# EAGLE design displayhuhu (EAGLE 9.5.1)
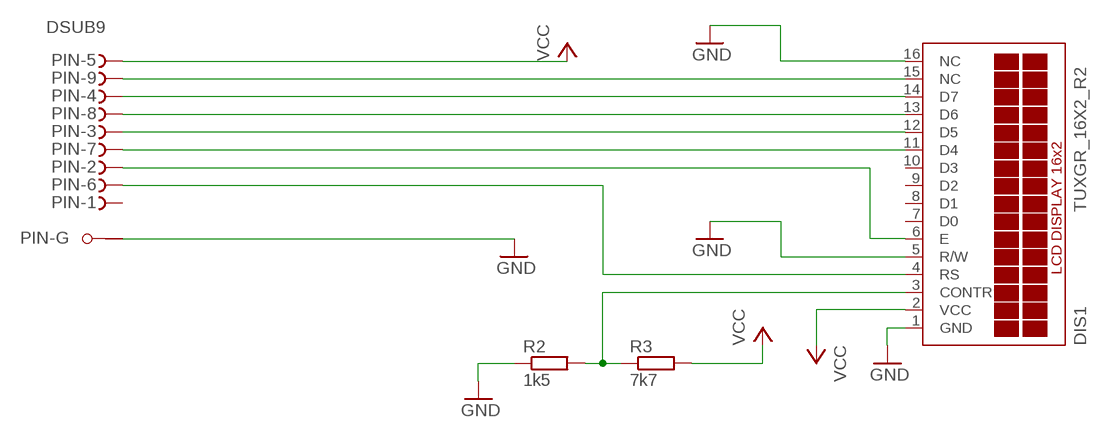
[diagram p0: schematic, sheet 1]

## Parts
DIS1  TUXGR_16X2_R2  [TUXGR_16X2_R2]
PIN  DSUB9  F09HPS  [F09HP]
R2  1k5  R-EU_0207/10  [0207/10]
R3  7k7  R-EU_0207/10  [0207/10]

## Nets
GND: DIS1.1(GND) DIS1.5(R/W) DIS1.16(NC) PIN.G1(-G:G1) R2.1
N$1: DIS1.6(E) PIN.2(-2:F)
N$2: DIS1.11(D4) PIN.7(-7:F)
N$3: DIS1.12(D5) PIN.3(-3:F)
N$4: DIS1.13(D6) PIN.8(-8:F)
N$5: DIS1.14(D7) PIN.4(-4:F)
N$6: DIS1.15(NC) PIN.9(-9:F)
N$8: DIS1.4(RS) PIN.6(-6:F)
N$9: DIS1.3(CONTR) R2.2 R3.1
VCC: DIS1.2(VCC) PIN.5(-5:F) R3.2
Unconnected: DIS1.7(D0) DIS1.8(D1) DIS1.9(D2) DIS1.10(D3) PIN.1(-1:F) PIN.G2(-G:G2)

## Library data of the parts
DIS1 = display-lcd:TUXGR_16X2_R2: Tuxgraphics LCD display 16x2 characters reflective, without background light Source: tuxgr_12x2_r2.pdf; OC_FARNELL: unknown; OC_NEWARK: unknown
PIN = con-subd:F09HPS: SUB-D; OC_FARNELL: unknown; OC_NEWARK: unknown
R2 R3 = rcl:R-EU_: RESISTOR, European symbol; SPICEPREFIX: R

## Board
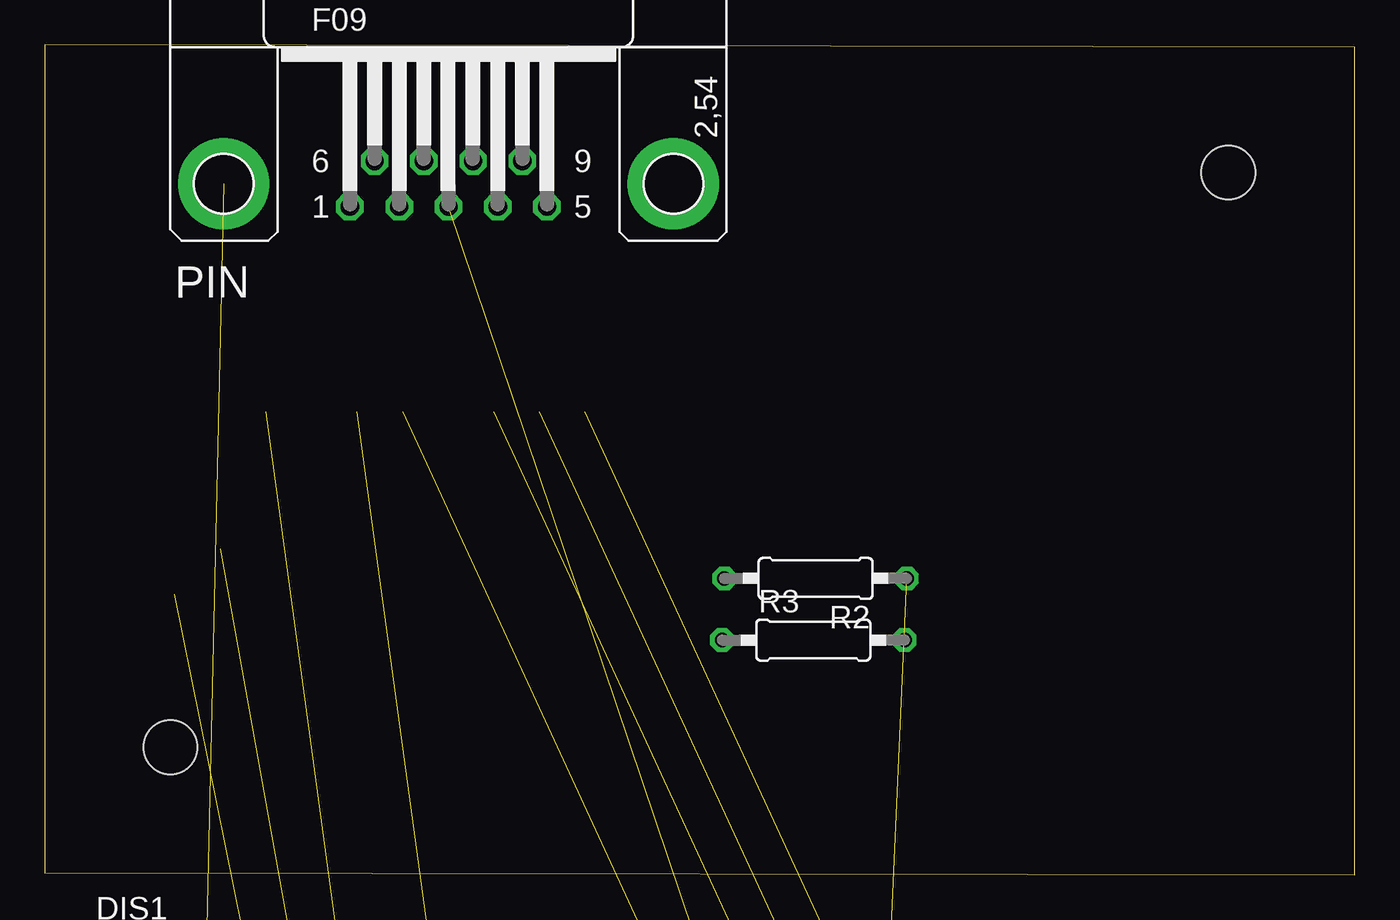
[diagram p1: board, top side]
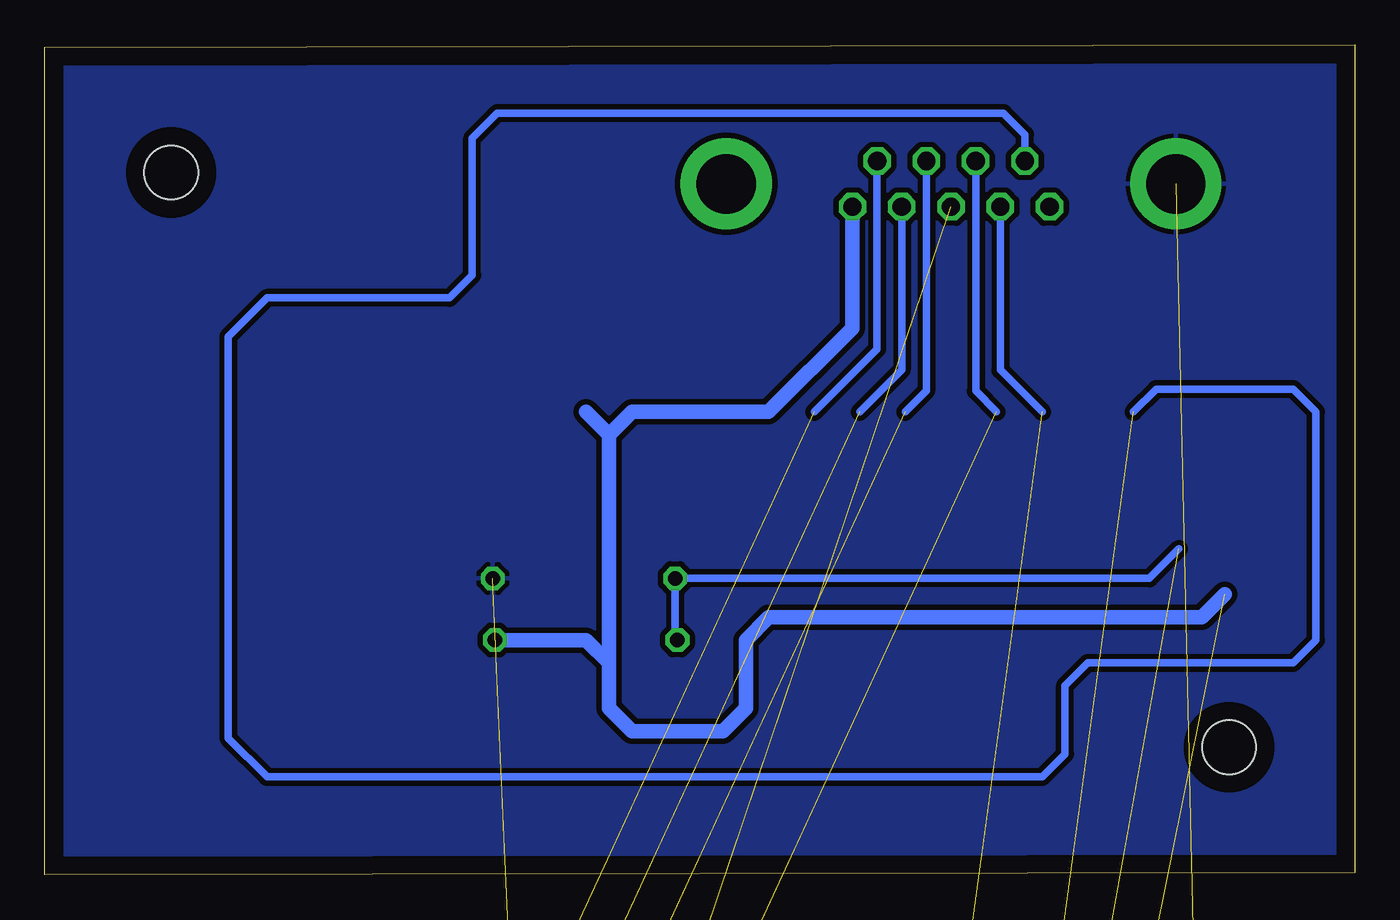
[diagram p2: board, bottom side, seen from below]

Size 72.95 x 46.22 mm. Coordinates in mm from the lower left corner, seen from the top.
Outline: 0,0.13 72.95,0 72.95,46.09 0,46.22 0,0.13
Copper layers (1*16): Top 0.035mm / dielectric 1.5mm / Bottom 0.035mm
Design rules "default *": minimum track width 6mil, minimum drill 0.35mm, track to track 6mil, track to pad 6mil, pad to pad 6mil, via to via 6mil, smd to smd 6mil, copper to edge 40mil, drill to drill 6mil, minimum pad ring 10mil, minimum via ring 8mil, stop-mask expansion 4mil, vias tented up to drill 0mil, thermal gap 10mil
Holes 3 mm at 6.99,7.11 65.91,39.12

### Footprints (pad centres in the part's own frame; a part is rotated, then mirrored left to right if it is on the bottom)
TUXGR_16X2_R2 = drill 1 pad 1.676: 1 -32,15.5; 2 -29.46,15.5; 3 -26.92,15.5; 4 -24.38,15.5; 5 -21.84,15.5; 6 -19.3,15.5; 7 -16.76,15.5; 8 -14.22,15.5; 9 -11.68,15.5; 10 -9.14,15.5; 11 -6.6,15.5; 12 -4.06,15.5; 13 -1.52,15.5; 14 1.02,15.5; 15 3.56,15.5; 16 6.1,15.5 | hole 2.5: -37.5,-15.5; 37.5,-15.5; -37.5,15.5; 37.5,15.5
F09HP = drill 1.016 octagon: 1 -5.486,-1.27; 2 -2.743,-1.27; 3 0,-1.27; 4 2.743,-1.27; 5 5.486,-1.27; 6 -4.115,1.27; 7 -1.372,1.27; 8 1.372,1.27; 9 4.115,1.27 | drill 3.302 pad 5.08: G1 -12.522,0; G2 12.522,0
0207/10 = drill 0.813 octagon: 1 -5.08,0; 2 5.08,0

### Placement (x,y rotation side)
DIS1  40.95,-20.91 0 top  (outside the outline)
PIN  22.48,38.48 0 top
R2  42.93,16.51 180 top
R3  42.8,13.08 0 top

### Tracks (layer width: path | path; a pad name or v marks a point on that pad's centre or on a via)
GND  (4 unrouted)
  pour Bottom (isolate 0.305): 0.95,45.09 71.95,45.09 71.95,1.09 0.95,1.09
N$1  (1 unrouted)
  Bottom 0.406: PIN.2 19.74,28.12 17.4,25.78
N$2  (1 unrouted)
  Bottom 0.406: PIN.7 21.11,26.95 19.94,25.78
N$3  (1 unrouted)
N$4  (1 unrouted)
  Bottom 0.406: PIN.8 23.85,26.95 25.02,25.78
N$5  (1 unrouted)
  Bottom 0.406: PIN.4 25.22,28.12 27.56,25.78
N$6  (1 unrouted)
  Bottom 0.406: PIN.9 26.59,29.29 30.1,25.78
N$8  (1 unrouted)
  Bottom 0.406: PIN.6 18.36,41.22 19.56,42.42 47.75,42.42 49.15,41.02 49.15,33.4 50.42,32.13 60.58,32.13 62.74,29.97 62.74,7.62 60.58,5.46 17.4,5.46 16.13,6.73 16.13,10.54 14.86,11.81 3.43,11.81 2.16,13.08 2.16,25.78 3.43,27.05 11.05,27.05 12.32,25.78
N$9  (1 unrouted)
  Bottom 0.406: 9.78,18.16 11.43,16.51 R2.2 37.85,13.21 R3.1
VCC  (1 unrouted)
  Bottom 0.813: 7.24,15.62 8.51,14.35 32.64,14.35 33.91,13.08 33.91,9.27 35.18,8 40.26,8 41.53,9.27 41.53,11.81 | 41.53,11.81 41.53,24.51 | 41.53,24.51 42.8,25.78 | 41.53,11.81 42.8,13.08 R3.2 | PIN.5 27.96,30.46 32.64,25.78 40.26,25.78 41.53,24.51